# Altium schematic sheet MCU.SchDoc
size A; SheetNumber: 1; SheetTotal: 3
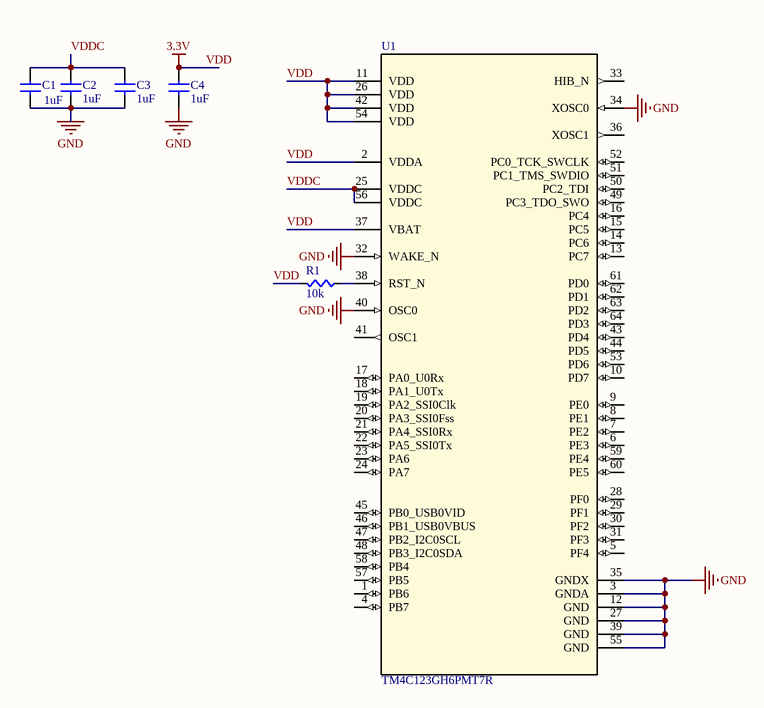
[diagram p0: MCU.SchDoc]

## Parts
C1  value 1uF  [CAPC0805]  (hidden comment: Cap)
C2  value 1uF  [CAPC0805]  (hidden comment: Cap)
C3  value 1uF  [CAPC0805]  (hidden comment: Cap)
C4  value 1uF  [CAPC0805]  (hidden comment: Cap)
R1  value 10k  [RES0603]  (hidden comment: Res)
U1  TM4C123GH6PMT7R  [TM4C123GH6PMT7R_L]

## Nets
GND: C1.2(B) C2.2(B) C3.2(B) C4.2(B) U1.3(GNDA) U1.12(GND) U1.27(GND) U1.32(WAKE_N) U1.34(XOSC0) U1.35(GNDX) U1.39(GND) U1.40(OSC0) U1.55(GND)
VDD: C4.1(A) R1.1(A) U1.2(VDDA) U1.11(VDD) U1.26(VDD) U1.37(VBAT) U1.42(VDD) U1.54(VDD)  [also labelled 3.3V]
VDDC: C1.1(A) C2.1(A) C3.1(A) U1.25(VDDC) U1.56(VDDC)
NetR1_2: R1.2(B) U1.38(RST_N)

Not connected (* = marked no-connect by the designer): U1 1(PB6) 4(PB7) 5(PF4) 6(PE3) 7(PE2) 8(PE1) 9(PE0) 10(PD7) 13(PC7) 14(PC6) 15(PC5) 16(PC4) 17(PA0_U0Rx) 18(PA1_U0Tx) 19(PA2_SSI0Clk) 20(PA3_SSI0Fss) 21(PA4_SSI0Rx) 22(PA5_SSI0Tx) 23(PA6) 24(PA7) 28(PF0) 29(PF1) 30(PF2) 31(PF3) 33(HIB_N) 36(XOSC1) 41(OSC1) 43(PD4) 44(PD5) 45(PB0_USB0VID) 46(PB1_USB0VBUS) 47(PB2_I2C0SCL) 48(PB3_I2C0SDA) 49(PC3_TDO_SWO) 50(PC2_TDI) 51(PC1_TMS_SWDIO) 52(PC0_TCK_SWCLK) 53(PD6) 57(PB5) 58(PB4) 59(PE4) 60(PE5) 61(PD0) 62(PD1) 63(PD2) 64(PD3)

## Library data of the parts
U1 = TM4C123GH6PMT7R: Imported; PartNumber: TM4C123GH6PMTR; Manufacturer: Texas Instruments; CompType: IC; PIN_COUNT: 64; Application_BuildNumber: *; Alternate_PartNumber: TM4C123GH6PMT; PackageReference: PM0064A; MountType: SMT; RoHS: Y; RefDes: RefDes; TYPE: TYPE; Value: Value
C1-C4 = Cap: Supplier 1: Digi-Key; Supplier Part Number 1: 490-3905-1-ND
R1 = Res: Supplier 1: Digi-Key; Supplier Part Number 1: RMCF0603JT10K0CT-ND